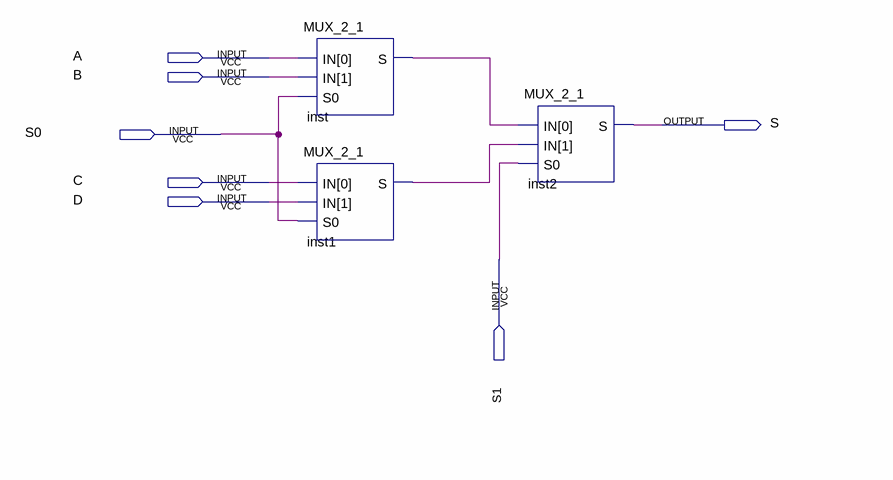
[diagram p0: schematic sheet]
// Quartus schematic MUX_4_1_1bit.bdf as structural Verilog: 3 symbols, 7 pins
module MUX_4_1_1bit (
  input  A,
  input  B,
  input  S0,
  input  C,
  input  D,
  input  S1,
  output S
);

  wire inst1_s, inst_s;

  MUX_2_1 inst (.IN({B, A}), .S0(S0), .S(inst_s));
  MUX_2_1 inst1 (.IN({D, C}), .S0(S0), .S(inst1_s));
  MUX_2_1 inst2 (.IN({inst1_s, inst_s}), .S0(S1), .S(S));
endmodule
